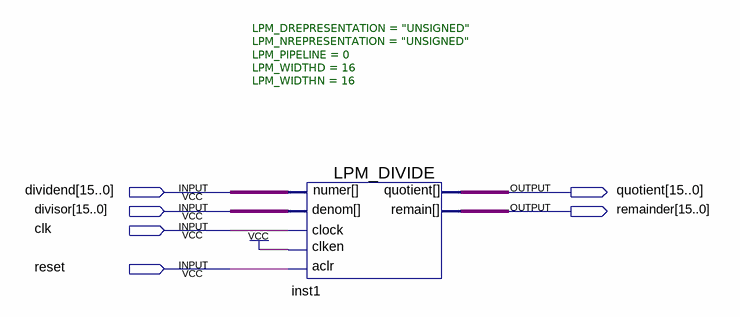
[diagram p0: schematic sheet]
// Quartus schematic altera_divider.bdf as structural Verilog: 1 symbols, 6 pins
module altera_divider (
  input  [15:0] dividend,
  input  [15:0] divisor,
  input  clk,
  input  reset,
  output [15:0] quotient,
  output [15:0] remainder
);

  LPM_DIVIDE #(.LPM_DREPRESENTATION("UNSIGNED"), .LPM_NREPRESENTATION("UNSIGNED"), .LPM_PIPELINE(0), .LPM_WIDTHD(16), .LPM_WIDTHN(16)) inst1 (
    .numer(dividend), .denom(divisor), .clock(clk), .clken(1'b1), .aclr(reset), .quotient(quotient),
    .remain(remainder));
endmodule
